# EAGLE schematic midi-vidi (EAGLE 6.6.0)
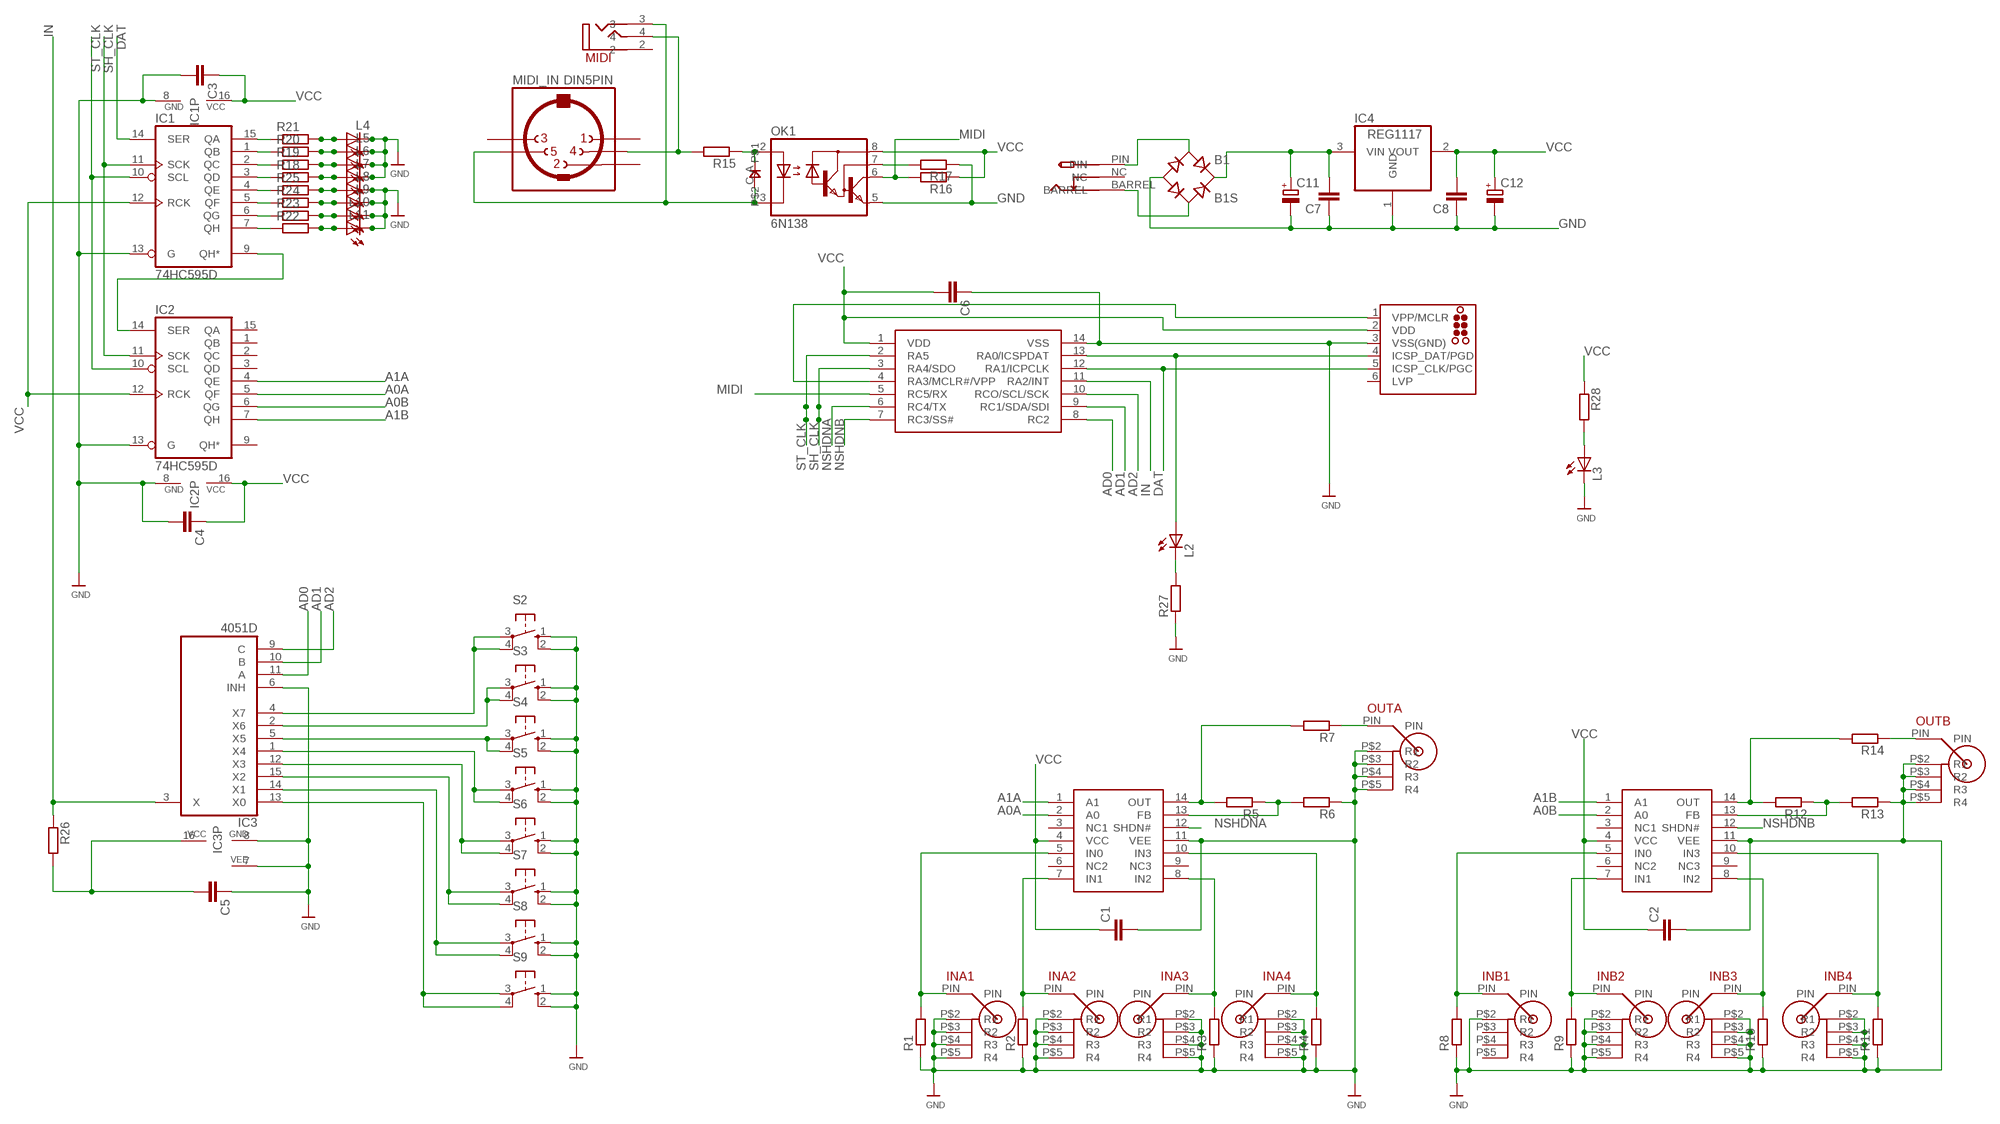
[diagram p0: schematic, sheet 1]

## Parts
B1  B1S  [MBS]
C1  C-EUC0805  [C0805]
C2  C-EUC0805  [C0805]
C3  C-EUC0805  [C0805]
C4  C-EUC0805  [C0805]
C5  C-EUC0805  [C0805]
C6  C-EUC0805  [C0805]
C7  C-EUC0805  [C0805]
C8  C-EUC0805  [C0805]
C11  CPOL-EUE2,5-6E  [E2,5-6E]
C12  CPOL-EUE2,5-6E  [E2,5-6E]
IC1  74HC595D  [SO16]
IC2  74HC595D  [SO16]
IC3  4051D  [SO16]
IC4  REG1117  [SOT223]
INA1  RCAVERT  [RCAVERT]
INA2  RCAVERT  [RCAVERT]
INA3  RCAVERT  [RCAVERT]
INA4  RCAVERT  [RCAVERT]
INB1  RCAVERT  [RCAVERT]
INB2  RCAVERT  [RCAVERT]
INB3  RCAVERT  [RCAVERT]
INB4  RCAVERT  [RCAVERT]
J1  TC2030-MCP-NL  [TC2030-MCP-NL]
L2  LED3MM  [LED3MM]
L3  LED3MM  [LED3MM]
L4  LED3MM  [LED3MM]
L5  LED3MM  [LED3MM]
L6  LED3MM  [LED3MM]
L7  LED3MM  [LED3MM]
L8  LED3MM  [LED3MM]
L9  LED3MM  [LED3MM]
L10  LED3MM  [LED3MM]
L11  LED3MM  [LED3MM]
MIDI  VERTICAL_3_5MM_SOCKET  [VERTICAL_3_5MM_SOCKET]
MIDI_IN  DIN5PIN  [EDGEDIN]
OK1  6N138  [DIL08]
OUTA  RCAVERT  [RCAVERT]
OUTB  RCAVERT  [RCAVERT]
R1  R-EU_R0805  [R0805]
R2  R-EU_R0805  [R0805]
R3  R-EU_R0805  [R0805]
R4  R-EU_R0805  [R0805]
R5  R-EU_R0805  [R0805]
R6  R-EU_R0805  [R0805]
R7  R-EU_R0805  [R0805]
R8  R-EU_R0805  [R0805]
R9  R-EU_R0805  [R0805]
R10  R-EU_R0805  [R0805]
R11  R-EU_R0805  [R0805]
R12  R-EU_R0805  [R0805]
R13  R-EU_R0805  [R0805]
R14  R-EU_R0805  [R0805]
R15  R-EU_R0805  [R0805]
R16  R-EU_R0805  [R0805]
R17  R-EU_R0805  [R0805]
R18  R-EU_R0805  [R0805]
R19  R-EU_R0805  [R0805]
R20  R-EU_R0805  [R0805]
R21  R-EU_R0805  [R0805]
R22  R-EU_R0805  [R0805]
R23  R-EU_R0805  [R0805]
R24  R-EU_R0805  [R0805]
R25  R-EU_R0805  [R0805]
R26  R-EU_R0805  [R0805]
R27  R-EU_R0805  [R0805]
R28  R-EU_R0805  [R0805]
S2  10-XX  [B3F-10XX]
S3  10-XX  [B3F-10XX]
S4  10-XX  [B3F-10XX]
S5  10-XX  [B3F-10XX]
S6  10-XX  [B3F-10XX]
S7  10-XX  [B3F-10XX]
S8  10-XX  [B3F-10XX]
S9  10-XX  [B3F-10XX]
U$2  PWR_SOCKET_2_1MM  [PWR_SOCKET_2_1MM]
U$5  0805DIODE  [0805DIODE]
U$12  MAX4311SO14  [SO14]
U$13  MAX4311SO14  [SO14]
U$14  PIC16F1825SO14  [SO14]

## Nets
A0A: IC2.5(QF) U$13.2(A0)
A0B: IC2.6(QG) U$12.2(A0)
A1A: IC2.4(QE) U$13.1(A1)
A1B: IC2.7(QH) U$12.1(A1)
AD0: IC3.11(A) U$14.8(RC2)
AD1: IC3.10(B) U$14.9(RC1/SDA/SDI)
AD2: IC3.9(C) U$14.10(RCO/SCL/SCK)
DAT: IC1.14(SER) J1.5(ICSP_CLK/PGC) U$14.12(RA1/ICPCLK)
GND: B1.- C1.2 C2.2 C3.2 C4.2 C5.1 C6.1 C7.1 C8.1 C11.- C12.- IC1.8(GND) IC1.13(G) IC2.8(GND) IC2.13(G) IC3.6(INH) IC3.7(VEE) IC3.8(GND) IC4.1(GND) INA1.P$2(R1) INA1.P$3(R2) INA1.P$4(R3) INA1.P$5(R4) INA2.P$2(R1) INA2.P$3(R2) INA2.P$4(R3) INA2.P$5(R4) INA3.P$2(R1) INA3.P$3(R2) INA3.P$4(R3) INA3.P$5(R4) INA4.P$2(R1) INA4.P$3(R2) INA4.P$4(R3) INA4.P$5(R4) INB1.P$2(R1) INB2.P$2(R1) INB2.P$3(R2) INB2.P$4(R3) INB2.P$5(R4) INB3.P$2(R1) INB3.P$3(R2) INB3.P$4(R3) INB3.P$5(R4) INB4.P$2(R1) INB4.P$3(R2) INB4.P$4(R3) INB4.P$5(R4) J1.3(VSS(GND)) L3.K(C) L4.K(C) L5.K(C) L6.K(C) L7.K(C) L8.K(C) L9.K(C) L10.K(C) L11.K(C) OK1.5(GND) OUTA.P$2(R1) OUTA.P$3(R2) OUTA.P$4(R3) OUTA.P$5(R4) OUTB.P$2(R1) OUTB.P$3(R2) OUTB.P$4(R3) OUTB.P$5(R4) R1.1 R2.1 R3.1 R4.1 R6.1 R8.1 R9.1 R10.1 R11.1 R13.1 R17.1 R27.1 S2.1(S) S2.2(S1) S3.1(S) S3.2(S1) S4.1(S) S4.2(S1) S5.1(S) S5.2(S1) S6.1(S) S6.2(S1) S7.1(S) S7.2(S1) S8.1(S) S8.2(S1) S9.1(S) S9.2(S1) U$12.11(VEE) U$13.11(VEE) U$14.14(VSS)
IN: IC3.3(X) R26.1 U$14.11(RA2/INT)
MIDI: OK1.6(VO) R16.2 U$14.5(RC5/RX)
N$1: INA4.PIN R4.2 U$13.10(IN3)
N$2: INA3.PIN R3.2 U$13.8(IN2)
N$3: INA2.PIN R2.2 U$13.7(IN1)
N$4: INA1.PIN R1.2 U$13.5(IN0)
N$5: R5.2 R7.2 U$13.14(OUT)
N$6: R5.1 R6.2 U$13.13(FB)
N$7: OUTA.PIN R7.1
N$8: OK1.2(A) R15.1 U$5.A
N$9: MIDI.4 MIDI_IN.4 R15.2
N$10: INB2.PIN R9.2 U$12.7(IN1)
N$11: INB3.PIN R10.2 U$12.8(IN2)
N$12: INB1.PIN R8.2 U$12.5(IN0)
N$13: R12.2 R14.2 U$12.14(OUT)
N$14: R12.1 R13.2 U$12.13(FB)
N$16: OUTB.PIN R14.1
N$17: INB4.PIN R11.2 U$12.10(IN3)
N$18: MIDI.3 MIDI_IN.5 OK1.3(C) U$5.C
N$19: L4.A R21.2
N$20: L5.A R20.2
N$21: L6.A R19.2
N$22: OK1.7(VB) R17.2
N$23: IC1.15(QA) R21.1
N$24: L7.A R18.2
N$25: IC1.1(QB) R20.1
N$26: IC1.2(QC) R19.1
N$27: IC1.3(QD) R18.1
N$28: IC1.4(QE) R25.1
N$29: IC1.5(QF) R24.1
N$30: IC1.6(QG) R23.1
N$31: IC1.7(QH) R22.1
N$32: L8.A R25.2
N$33: L9.A R24.2
N$34: L10.A R23.2
N$35: L11.A R22.2
N$36: L2.K(C) R27.2
N$37: IC3.4(X7) S2.3(P) S2.4(P1)
N$38: IC3.2(X6) S3.3(P) S3.4(P1)
N$39: IC3.5(X5) S4.3(P) S4.4(P1)
N$40: IC3.1(X4) S5.3(P) S5.4(P1)
N$41: IC3.12(X3) S6.3(P) S6.4(P1)
N$42: IC3.15(X2) S7.3(P) S7.4(P1)
N$43: IC3.14(X1) S8.3(P) S8.4(P1)
N$44: IC3.13(X0) S9.3(P) S9.4(P1)
N$45: J1.4(ICSP_DAT/PGD) L2.A U$14.13(RA0/ICSPDAT)
N$46: B1.AC1 U$2.PIN
N$47: IC1.9(QH*) IC2.14(SER)
N$48: J1.1(VPP/MCLR) U$14.4(RA3/MCLR#/VPP)
N$49: B1.AC2 U$2.BARREL
N$50: L3.A R28.2
N$51: B1.+ C7.2 C11.+ IC4.3(VIN)
NSHDNA: U$13.12(SHDN#) U$14.6(RC4/TX)
NSHDNB: U$12.12(SHDN#) U$14.7(RC3/SS#)
SH_CLK: IC1.11(SCK) IC2.11(SCK) U$14.3(RA4/SDO)
ST_CLK: IC1.10(SCL) IC2.10(SCL) U$14.2(RA5)
VCC: C1.1 C2.1 C3.1 C4.1 C5.2 C6.2 C8.2 C12.+ IC1.12(RCK) IC1.16(VCC) IC2.12(RCK) IC2.16(VCC) IC3.16(VCC) IC4.2(VOUT) J1.2(VDD) OK1.8(VCC) R16.1 R26.2 R28.1 U$12.4(VCC) U$13.4(VCC) U$14.1(VDD)
Unconnected: IC2.1(QB) IC2.2(QC) IC2.3(QD) IC2.9(QH*) IC2.15(QA) INB1.P$3(R2) INB1.P$4(R3) INB1.P$5(R4) J1.6(LVP) MIDI.2 MIDI_IN.1 MIDI_IN.2 MIDI_IN.3 U$2.NC U$12.3(NC1) U$12.6(NC2) U$12.9(NC3) U$13.3(NC1) U$13.6(NC2) U$13.9(NC3)

## Library data of the parts
B1 = rectifier:B*S: Surface Mount Glass Passivated Bridge Rectifiers Source: Comchip Bridge Rectifiers B05S-G_B10S-G.pdf
C1-C8 = rcl:C-EU: CAPACITOR, European symbol
C11 C12 = rcl:CPOL-EU: POLARIZED CAPACITOR, European symbol
IC1 IC2 = 74xx-eu:74*595: 8-bit SHIFT REGISTER, output latch
IC3 = 40xx:4051: 8-channel ANALOG MULTIPLEXER
IC4 = burr-brown:REG1117: 800mA and 1A Low Dropout (LDO) Positive Regulator 1.8V, 2.5V, 2.85V, 3.3V, 5V, and Adj; MPN: REG1117; OC_FARNELL: 1097566; OC_NEWARK: 14P6981
INA1-INA4 INB1-INB4 OUTA OUTB = jason_eagle6:RCAVERT
J1 = tag-connect:TC2030: TAG-CONNECT ICSP Connector Manufacturer: Tag-Connect <http://www.tag-connect.com> Cable for easy In-Circuit Serial Programming. Designed for Microchip ICD2, suitable for many others. Two variants - one "with legs" (for hands-free fit on PCB) and another "without legs" for quick programming. PAD Description 1 MCLR/Vpp 2 Vdd 3 GND 4 PGD (ISPDAT) 5 PGC (ISPCLK) 6 nc (used for LVP) ©2009 ROFA.cz - modified and updated by Robert Darlington ‹rdarlington@gmail.com›
L2-L11 = led:LED: LED OSRAM: - CHIPLED LG R971, LG N971, LY N971, LG Q971, LY Q971, LO R971, LY R971 LH N974, LH R974 LS Q976, LO Q976, LY Q976 LO Q996 - Hyper CHIPLED LW Q18S LB Q993, LB Q99A, LB R99A - SideLED LS A670, LO A670, LY A670, LG A670, LP A670 LB A673, LV A673, LT A673, LW A673 LH A674 LY A675 LS A676, LA A676, LO A676, LY A676, LW A676 LS A679, LY A679, LG A679 - Hyper Micro SIDELED® LS Y876, LA Y876, LO Y876, LY Y876 LT Y87S - SmartLED LW L88C, LW L88S LB L89C, LB L89S, LG L890 LS L89K, LO L89K, LY L89K LS L896, LA L896, LO L896, LY L896 - TOPLED LS T670, LO T670, LY T670, LG T670, LP T670 LSG T670, LSP T670, LSY T670, LOP T670, LYG T670 LG T671, LOG T671, LSG T671 LB T673, LV T673, LT T673, LW T673 LH T674 LS T676, LA T676, LO T676, LY T676, LB T676, LH T676, LSB T676, LW T676 LB T67C, LV T67C, LT T67C, LS T67K, LO T67K, LY T67K, LW E67C LS E67B, LA E67B, LO E67B, LY E67B, LB E67C, LV E67C, LT E67C LW T67C LS T679, LY T679, LG T679 LS T770, LO T770, LY T770, LG T770, LP T770 LB T773, LV T773, LT T773, LW T773 LH T774 LS E675, LA E675, LY E675, LS T675 LS T776, LA T776, LO T776, LY T776, LB T776 LHGB T686 LT T68C, LB T68C - Hyper Mini TOPLED® LB M676 - Mini TOPLED Santana® LG M470 LS M47K, LO M47K, LY M47K Source: http://www.osram.convergy.de LUXEON: - LUMILED® LXK2-PW12-R00, LXK2-PW12-S00, LXK2-PW14-U00, LXK2-PW14-V00 LXK2-PM12-R00, LXK2-PM12-S00, LXK2-PM14-U00 LXK2-PE12-Q00, LXK2-PE12-R00, LXK2-PE12-S00, LXK2-PE14-T00, LXK2-PE14-U00 LXK2-PB12-K00, LXK2-PB12-L00, LXK2-PB12-M00, LXK2-PB14-N00, LXK2-PB14-P00, LXK2-PB14-Q00 LXK2-PR12-L00, LXK2-PR12-M00, LXK2-PR14-Q00, LXK2-PR14-R00 LXK2-PD12-Q00, LXK2-PD12-R00, LXK2-PD12-S00 LXK2-PH12-R00, LXK2-PH12-S00 LXK2-PL12-P00, LXK2-PL12-Q00, LXK2-PL12-R00 Source: www.luxeon.com KINGBRIGHT: KA-3528ASYC Source: www.kingbright.com
MIDI = jason_eagle6:VERTICAL_3_5MM_SOCKET
MIDI_IN = jason_eagle6:DIN5PIN: Female CONNECTOR 5 pins 90 deg. with shield, horizontal (DIN 41524)
OK1 = optocoupler:6N138: MOTOROLA OPTO COUPLER; MF: VISHAY/TELEFUNKEN; MPN: 6N138; OC_FARNELL: 9860150; OC_NEWARK: 35K5294
R1-R28 = rcl:R-EU_: RESISTOR, European symbol
S2-S9 = switch-omron:10-XX: OMRON SWITCH; MPN: B3F-1000; OC_FARNELL: 176432; OC_NEWARK: 36M3542
U$2 = jason_eagle6:PWR_SOCKET_2_1MM
U$5 = jasons_stuff:0805DIODE
U$12 U$13 = jason_eagle6:MAX4311
U$14 = jasons_stuff:PIC16F1825